# EAGLE design soth-ext (EAGLE 7.2.0)
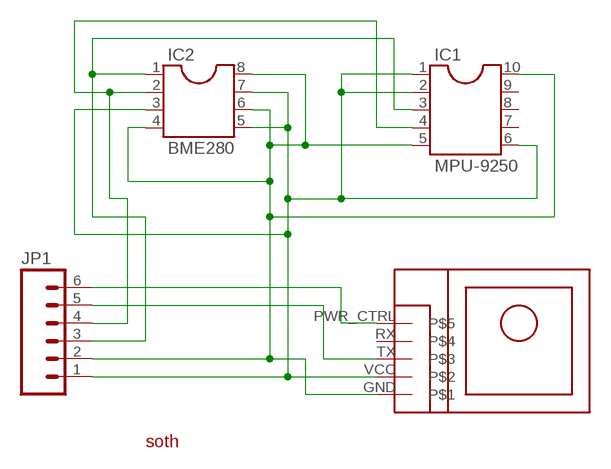
[diagram p0: schematic, sheet 1]

## Parts
IC1  MPU-9250  DIL10  [DIL10]
IC2  BME280  DIL8  [DIL08]
JP1  M06SILK_FEMALE_PTH  [1X06]
U$1  GM318B  [GM318B]
U$2  SOTH_LOGO  [SILK_LOGO]

## Nets
GND [GND]: IC1.5 IC1.10 IC2.4 IC2.6 IC2.8 JP1.2 U$1.GND
N$2: IC1.1 IC1.2 IC1.6 IC2.3 IC2.5 IC2.7 JP1.1 U$1.VCC
N$3: JP1.5 U$1.TX
N$4: JP1.6 U$1.PWR_CTRL
N$7: IC1.4 IC2.2 JP1.4
N$8: IC1.3 IC2.1 JP1.3
Unconnected: IC1.7 IC1.8 IC1.9 U$1.RX

## Library data of the parts
IC1 = ic-package:DIL10: Dual In Line / Socket
IC2 = ic-package:DIL8: Dual In Line / Socket
JP1 = SparkFun-Connectors:M06: Header 6 Standard 6-pin 0.1" header. Use with straight break away headers (SKU : PRT-00116), right angle break away headers (PRT-00553), swiss pins (PRT-00743), machine pins (PRT-00117), and female headers (PRT-00115). Molex polarized connector foot print use with SKU : PRT-08094 with associated crimp pins and housings. NOTES ON THE VARIANTS LOCK and LOCK_LONGPADS... This footprint was designed to help hold the alignment of a through-hole component (i.e. 6-pin header) while soldering it into place. You may notice that each hole has been shifted either up or down by 0.005 of an inch from it's more standard position (which is a perfectly straight line). This slight alteration caused the pins (the squares in the middle) to touch the edges of the holes. Because they are alternating, it causes a "brace" to hold the component in place. 0.005 has proven to be the perfect amount of "off-center" position when using our standard breakaway headers. Although looks a little odd when you look at the bare footprint, once you have a header in there, the alteration is very hard to notice. Also,if you push a header all the way into place, it is covered up entirely on the bottom side. This idea of altering the position of holes to aid alignment will be further integrated into the Sparkfun Library for other footprints. It can help hold any component with 3 or more connection pins.; PROD_ID: CONN-08437
U$1 = Soth:GM318B
U$2 = Soth:SOTH_LOGO: soth slik logo

## Board
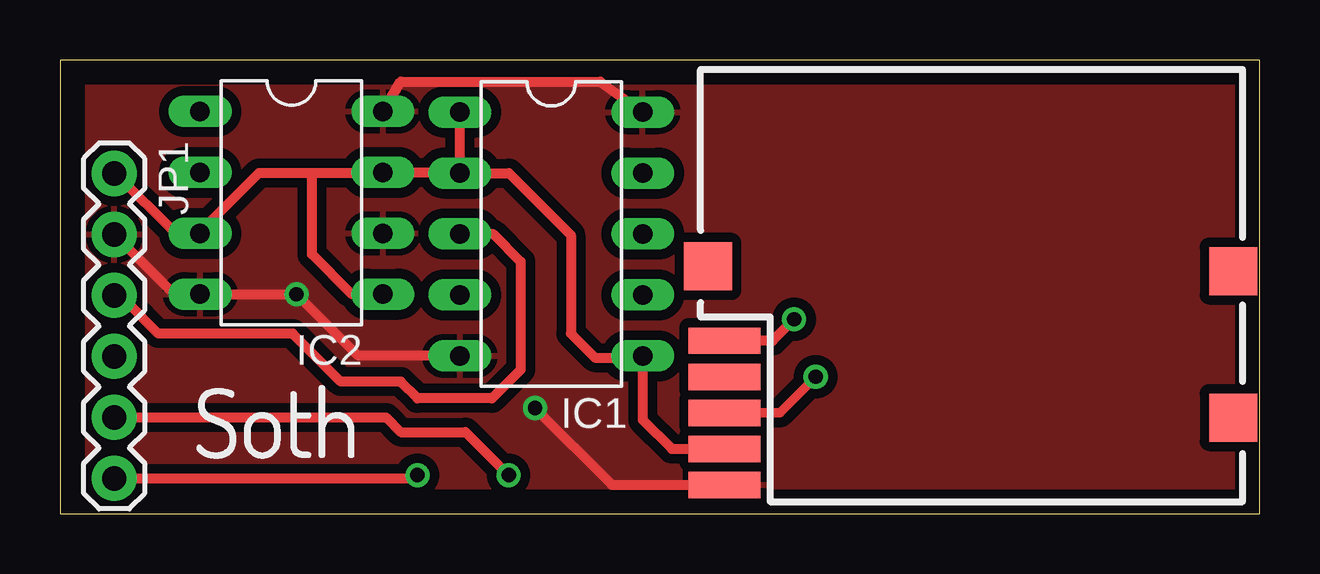
[diagram p1: board, top side]
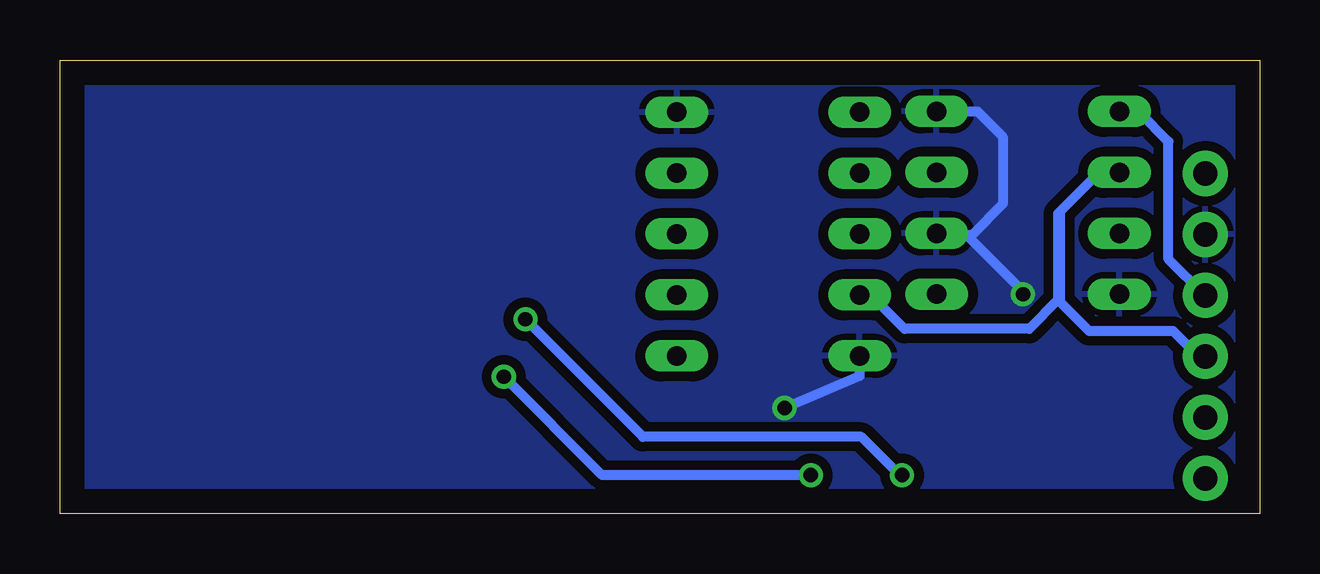
[diagram p2: board, bottom side, seen from below]

Size 50 x 18.9 mm. Coordinates in mm from the lower left corner, seen from the top.
Outline: 0,0 50,0 50,18.9 0,18.9 0,0
Copper layers (1*16): Top 0.035mm / dielectric 1.5mm / Bottom 0.035mm
Design rules "default": minimum track width 10mil, minimum drill 24mil, track to track 8mil, track to pad 8mil, pad to pad 8mil, via to via 8mil, smd to smd 8mil, copper to edge 40mil, drill to drill 8mil, minimum pad ring 10mil, minimum via ring 8mil, stop-mask expansion 4mil, vias tented up to drill 0mil, thermal gap 10mil

### Footprints (pad centres in the part's own frame; a part is rotated, then mirrored left to right if it is on the bottom)
DIL10 = drill 0.813 long: 1 -5.08,-3.81; 2 -2.54,-3.81; 3 0,-3.81; 4 2.54,-3.81; 5 5.08,-3.81; 6 5.08,3.81; 7 2.54,3.81; 8 0,3.81; 9 -2.54,3.81; 10 -5.08,3.81
DIL08 = drill 0.813 long: 1 -3.81,-3.81; 2 -1.27,-3.81; 3 1.27,-3.81; 4 3.81,-3.81; 5 3.81,3.81; 6 1.27,3.81; 7 -1.27,3.81; 8 -3.81,3.81
1X06 = drill 1.016 pad 1.88: 1 0,0; 2 2.54,0; 3 5.08,0; 4 7.62,0; 5 10.16,0; 6 12.7,0
GM318B = smd 3 x 1.1: GND 1,0.7; PWR_CTRL 1,6.7; RX 1,5.2; TX 1,3.7; VCC 1,2.2 | smd 2 x 2: MOUNT1 22.2,9.6; MOUNT2 22.2,3.5; MOUNT3 0.3,9.8

### Placement (x,y rotation side)
IC1  20.48,11.65 270 top
IC2  9.65,12.95 270 top
JP1  2.26,14.17 270 top
U$1  26.7,0.5 0 top
U$2  5.7,2.3 0 top

### Tracks (layer width: path | path; a pad name or v marks a point on that pad's centre or on a via)
GND  (via drill 0.6)
  Top 0.406: JP1.2 4.7,9.2 5.28,9.2 IC2.4 v9.86,9.14 12.4,6.6 16.14,6.6 IC1.5 | 12.88,11.6 IC2.6 | IC2.8 14.2,18 22.52,18 IC1.10 | v19.8,4.4 23,1.2 U$1.GND
  Bottom 0.406: IC2.8 11.76,16.76 10.7,15.7 10.7,12.9 12,11.6 12.2,11.6 | 12.2,11.6 12.88,11.6 IC2.6 | v9.86,9.14 9.86,9.26 12.2,11.6 | IC1.5 16.67,5.73 v19.8,4.4
  pour Bottom (isolate 0.4): 0.5,18.5 49.7,18.4 49.7,0.3 0.5,0.5
  pour Top (isolate 0.4): 0.5,18.5 49.7,18.4 49.7,0.4 0.5,0.5
N$2
  Top 0.406: JP1.1 2.33,14.17 4.8,11.7 5.32,11.7 IC2.3 5.78,11.68 8.3,14.2 10.6,14.2 | 10.6,14.2 12.94,14.2 IC2.7 16.14,14.22 IC1.2 | IC1.2 IC1.1 | IC1.2 18.71,14.19 21.3,11.6 21.3,7.5 22.3,6.5 23.72,6.5 IC1.6 24.29,3.91 25.5,2.7 U$1.VCC | IC2.5 12.16,9.14 10.5,10.8 10.5,14.1 10.6,14.2
N$3  (via drill 0.6)
  Top 0.4: U$1.TX 30,4.2 v31.5,5.7
  Top 0.406: JP1.5 13.59,4.01 14.2,3.4 16.9,3.4 v18.7,1.6
  Bottom 0.406: v18.7,1.6 27.4,1.6 v31.5,5.7
N$4  (via drill 0.6)
  Top 0.406: JP1.6 14.77,1.47 v14.9,1.6 | v30.6,8.1 29.7,7.2 U$1.PWR_CTRL
  Bottom 0.406: v14.9,1.6 15,1.6 16.6,3.2 25.7,3.2 v30.6,8.1
N$7
  Bottom 0.406: JP1.4 2.55,6.55 3.6,7.6 7.1,7.6 8.3,8.8 8.3,12.6 6.7,14.2 5.86,14.2 IC2.2 6.68,14.22 8.4,12.5 8.4,8.9 9.6,7.7 14.8,7.7 15.9,8.8 16.36,8.8 IC1.4
N$8
  Top 0.406: IC1.3 18.05,11.65 19.2,10.5 19.2,6 18,4.8 14.9,4.8 14.2,5.5 11.7,5.5 9.7,7.5 4.1,7.5 2.8,8.8 2.55,8.8 JP1.3
  Bottom 0.406: JP1.3 2.29,9.09 3.8,10.6 3.8,15.5 5,16.7 5.78,16.7 IC2.1